# EAGLE design Adaptor (EAGLE 9.6.2)
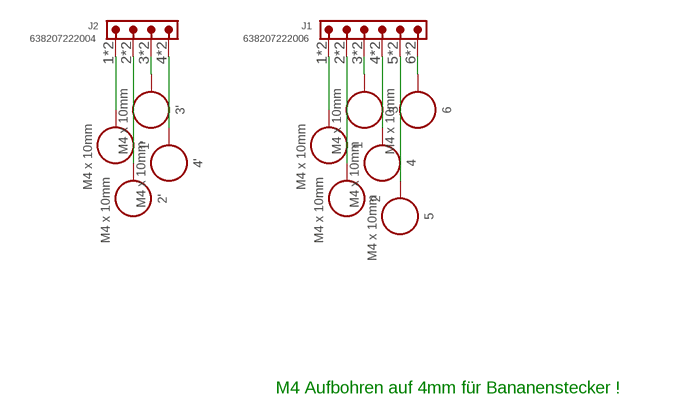
[diagram p0: schematic, sheet 1]

## Parts
1  M4 x 10mm  WA-SMSI_9774XXX482_9774100482  [WA-SMSI_9774100482]
1'  M4 x 10mm  WA-SMSI_9774XXX482_9774100482  [WA-SMSI_9774100482]
2  M4 x 10mm  WA-SMSI_9774XXX482_9774100482  [WA-SMSI_9774100482]
2'  M4 x 10mm  WA-SMSI_9774XXX482_9774100482  [WA-SMSI_9774100482]
3  M4 x 10mm  WA-SMSI_9774XXX482_9774100482  [WA-SMSI_9774100482]
3'  M4 x 10mm  WA-SMSI_9774XXX482_9774100482  [WA-SMSI_9774100482]
4  M4 x 10mm  WA-SMSI_9774XXX482_9774100482  [WA-SMSI_9774100482]
4'  M4 x 10mm  WA-SMSI_9774XXX482_9774100482  [WA-SMSI_9774100482]
5  M4 x 10mm  WA-SMSI_9774XXX482_9774100482  [WA-SMSI_9774100482]
6  M4 x 10mm  WA-SMSI_9774XXX482_9774100482  [WA-SMSI_9774100482]
J1  638207222006  638207222006  [638207222006]
J2  638207222004  638207222004  [638207222004]

## Nets
N$1: 1.1 J1.1 J1.A1
N$2: 2.1 J1.2 J1.A2
N$3: 3.1 J1.3 J1.A3
N$4: 4.1 J1.4 J1.A4
N$5: 5.1 J1.5 J1.A5
N$6: 6.1 J1.6 J1.A6
N$7: 1'.1 J2.1 J2.A1
N$8: 2'.1 J2.2 J2.A2
N$9: 4'.1 J2.4 J2.A4
N$10: 3'.1 J2.3 J2.A3

## Notes on the sheet
- M4 Aufbohren auf 4mm für Bananenstecker !

## Library data of the parts
1 1' 2 2' 3 3' 4 4' 5 6 = Wurth_Assembly_WA-SMSI:WA-SMSI_9774XXX482: WA-SMSI Steel Spacer with internal Thread M4 Applications Assembling of PCBs to housing and to other PCBs For distances from 1 to 10 mm Fast and precise process Strong holding forces and torques Highest process reliability Instant removable Polyimide Tape Properties Material Steel Surface Tin Ti M4 Solder Paste Thickness 150 µm Tightening Torque (Value) 1.2 N*m General Information Operating Temperature -55 up to +150 °C °C <https://www.we-online.com/catalog/media/o92909v209%20Family_WA_SMSI_M3.jpg> Details see: https://www.we-online.com/catalog/en/SMSI_SMT_STEEL_SPACER_M4_THREAD_INTERNAL Updated by Ella Wu 2021-06-03 2021(C) Wurth Elektronik; DATASHEET-URL: https://www.we-online.com/catalog/datasheet/9774100482.pdf; INNER-DIAMETER: 5.2mm; INNER-THREAD-LENGTH: -; OUTER-DIAMETER: 8.2mm; PART-NUMBER: 9774100482; PIN-LENGTH: 10mm; THREAD: M4
J1 = Wurth_Connectors_WR-FAST:638207222006: WR-FAST 5.08 mm THT Male Header Vertical Blade 2863 KIND PROPERTIES Pitch 5.08 mm Gender Male MATERIAL PROPERTIES Insulator Material PC Insulator Flammability Rating UL94 V-0 Insulator Color Black Contact Material Steel Contact Plating Tin Contact Type Stamped GENERAL INFORMATION Operating Temperature -30 up to +120 °C Working Voltage 300 V (AC) Withstanding Voltage 1600 V (AC) Contact Resistance 20 mΩ RISO 5 MΩ IR 16 A CERTIFICATION cULus Approval E150931 PACKAGING PROPERTIES Packaging Box <https://www.we-online.com/catalog/media/o165124v209%20Family_ConFAST_638207222004.jpg> Details see: https://www.we-online.com/catalog/en/FAST_5_08_THT_MALE_VERTICAL_6382072220XX/ Updated by Ella Wu 2020-08-11 2020(C) Wurth Elektronik; CONTACT-RESISTANCE: 20mOhm; DATASHEET-URL: https://www.we-online.com/catalog/datasheet/638207222006.pdf; GENDER: Male; IR: 16A; MOUNT: THT; PART-NUMBER: 638207222006; PINS: 6; PITCH: 5.08mm; TYPE: Vertical; WORKING-VOLTAGE: 300V(AC)
J2 = Wurth_Connectors_WR-FAST:638207222004: WR-FAST 5.08 mm THT Male Header Vertical Blade 2863 KIND PROPERTIES Pitch 5.08 mm Gender Male MATERIAL PROPERTIES Insulator Material PC Insulator Flammability Rating UL94 V-0 Insulator Color Black Contact Material Steel Contact Plating Tin Contact Type Stamped GENERAL INFORMATION Operating Temperature -30 up to +120 °C Working Voltage 300 V (AC) Withstanding Voltage 1600 V (AC) Contact Resistance 20 mΩ RISO 5 MΩ IR 16 A CERTIFICATION cULus Approval E150931 PACKAGING PROPERTIES Packaging Box <https://www.we-online.com/catalog/media/o165124v209%20Family_ConFAST_638207222004.jpg> Details see: https://www.we-online.com/catalog/en/FAST_5_08_THT_MALE_VERTICAL_6382072220XX/ Updated by Ella Wu 2020-08-11 2020(C) Wurth Elektronik; CONTACT-RESISTANCE: 20mOhm; DATASHEET-URL: https://www.we-online.com/catalog/datasheet/638207222004.pdf; GENDER: Male; IR: 16A; MOUNT: THT; PART-NUMBER: 638207222004; PINS: 4; PITCH: 5.08mm; TYPE: Vertical; WORKING-VOLTAGE: 300V(AC)

## Board
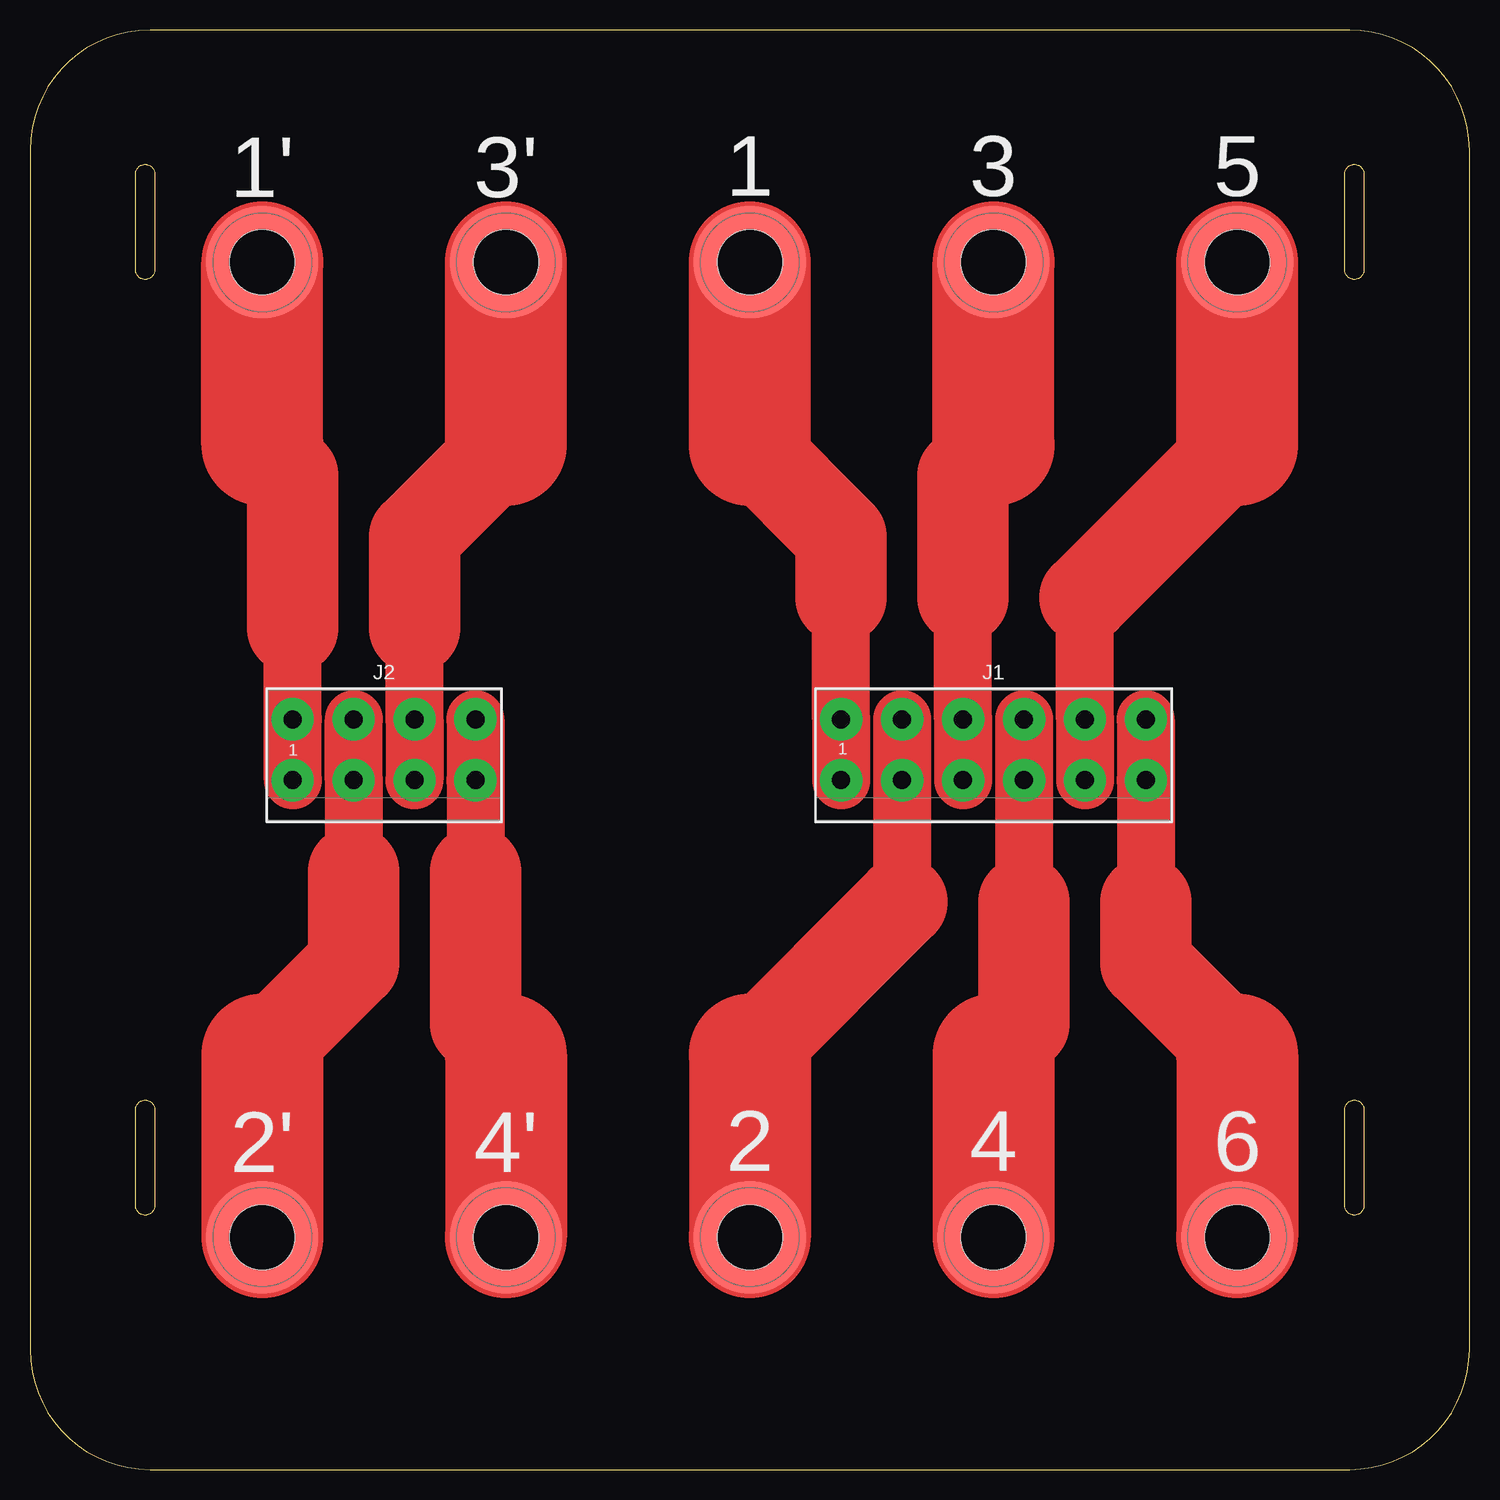
[diagram p1: board, top side]

Size 120 x 120 mm. Coordinates in mm from the lower left corner, seen from the top.
Outline: 0,110 0,10 arc90 10,0 110,0 arc90 120,10 120,110 arc90 110,120 10,120 arc90 0,110
Outline: 110.4,99.2 arc-90 109.6,100 109.6,108 arc-90 110.4,108.8 arc-90 111.2,108 111.2,100 arc-90 110.4,99.2
Outline: 110.4,21.2 arc-90 109.6,22 109.6,30 arc-90 110.4,30.8 arc-90 111.2,30 111.2,22 arc-90 110.4,21.2
Outline: 9.6,99.2 arc-90 8.8,100 8.8,108 arc-90 9.6,108.8 arc-90 10.4,108 10.4,100 arc-90 9.6,99.2
Outline: 9.6,21.2 arc-90 8.8,22 8.8,30 arc-90 9.6,30.8 arc-90 10.4,30 10.4,22 arc-90 9.6,21.2
Copper layers (1*16): Top 0.035mm / dielectric 1.5mm / Bottom 0.035mm
Design rules "default *": minimum track width 6mil, minimum drill 0.3mm, track to track 6mil, track to pad 6mil, pad to pad 5mil, via to via 6mil, smd to smd 5mil, copper to edge 0mil, drill to drill 6mil, minimum pad ring 10mil, minimum via ring 8mil, stop-mask expansion 4mil, vias tented up to drill 0.5mm, thermal gap 10mil

### Footprints (pad centres in the part's own frame; a part is rotated, then mirrored left to right if it is on the bottom)
WA-SMSI_9774100482 = smd 9.4 x 9.4: 1 0,0 | hole 5.4: 0,0
638207222006 = drill 1.5: 1 -12.7,2.54; 2 -7.62,2.54; 3 -2.54,2.54; 4 2.54,2.54; 5 7.62,2.54; 6 12.7,2.54; A1 -12.7,-2.54; A2 -7.62,-2.54; A3 -2.54,-2.54; A4 2.54,-2.54; A5 7.62,-2.54; A6 12.7,-2.54
638207222004 = drill 1.5: 1 -7.62,2.54; 2 -2.54,2.54; 3 2.54,2.54; 4 7.62,2.54; A1 -7.62,-2.54; A2 -2.54,-2.54; A3 2.54,-2.54; A4 7.62,-2.54

### Placement (x,y rotation side)
1  60,100.64 0 top
1'  19.36,100.64 0 top
2  60,19.36 0 top
2'  19.36,19.36 0 top
3  80.32,100.64 0 top
3'  39.68,100.64 0 top
4  80.32,19.36 0 top
4'  39.68,19.36 0 top
5  100.64,100.64 0 top
6  100.64,19.36 0 top
J1  80.32,60 0 top
J2  29.52,60 0 top

### Tracks (layer width: path | path; a pad name or v marks a point on that pad's centre or on a via)
N$1
  Top 10.16: 60,85.4 1.1
  Top 4.826: J1.A1 J1.1 67.62,72.7
  Top 7.62: 67.62,72.7 67.62,77.78 60,85.4
N$2
  Top 10.16: 60,34.6 2.1
  Top 4.826: J1.2 J1.A2 72.7,47.3
  Top 7.62: 72.7,47.3 60,34.6
N$3
  Top 10.16: 80.32,85.4 3.1
  Top 4.826: J1.A3 J1.3 77.78,72.7
  Top 7.62: 77.78,72.7 77.78,82.86 80.32,85.4
N$4
  Top 10.16: 80.32,34.6 4.1
  Top 4.826: J1.4 J1.A4 82.86,47.3
  Top 7.62: 82.86,47.3 82.86,37.14 80.32,34.6
N$5
  Top 10.16: 100.64,85.4 5.1
  Top 4.826: J1.A5 J1.5 87.94,72.7
  Top 7.62: 87.94,72.7 100.64,85.4
N$6
  Top 10.16: 100.64,34.6 6.1
  Top 4.826: J1.6 J1.A6 93.02,47.3
  Top 7.62: 93.02,47.3 93.02,42.22 100.64,34.6
N$7
  Top 10.16: 19.36,85.4 1'.1
  Top 4.826: J2.A1 J2.1 21.9,70.16
  Top 7.62: 21.9,70.16 21.9,82.86 19.36,85.4
N$8
  Top 10.16: 19.36,34.6 2'.1
  Top 4.826: J2.2 J2.A2 26.98,49.84
  Top 7.62: 26.98,49.84 26.98,42.22 19.36,34.6
N$9
  Top 10.16: 39.68,34.6 4'.1
  Top 4.826: J2.4 J2.A4 37.14,49.84
  Top 7.62: 37.14,49.84 37.14,37.14 39.68,34.6
N$10
  Top 10.16: 39.68,85.4 3'.1
  Top 4.826: J2.A3 J2.3 32.06,70.16
  Top 7.62: 32.06,70.16 32.06,77.78 39.68,85.4